# Altium schematic sheet power.SchDoc
size A4
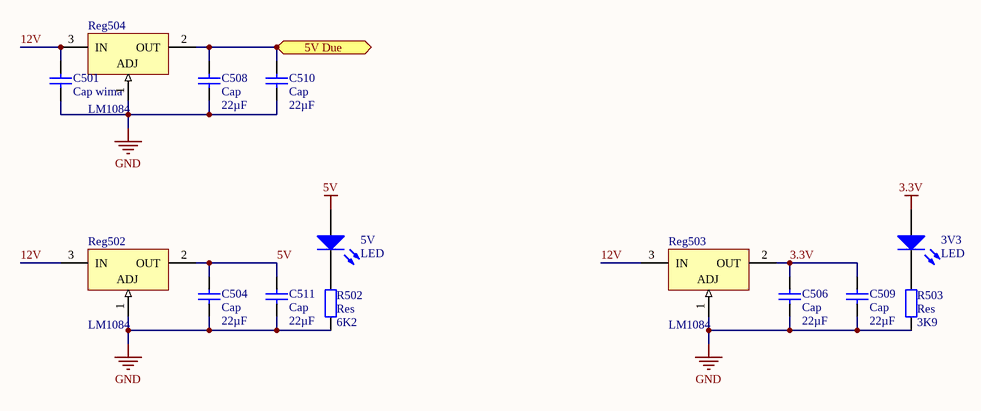
[diagram p0: power.SchDoc]

## Parts
3V3  LED  [LED 3mm]
5V  LED  [LED 3mm]
C501  Cap wima  [Wima 11x16x7.2mm]
C504  Cap  value 22µF  [1206 footprint]
C506  Cap  value 22µF  [1206 footprint]
C508  Cap  value 22µF  [1206 footprint]
C509  Cap  value 22µF  [1206 footprint]
C510  Cap  value 22µF  [1206 footprint]
C511  Cap  value 22µF  [1206 footprint]
R502  Res  value 6K2  [1206 footprint]
R503  Res  value 3K9  [1206 footprint]
Reg502  LM1084  [LM1084]
Reg503  LM1084  [LM1084]
Reg504  LM1084  [LM1084]

## Ports
5V Due (bidir)

## Nets
3.3V: 3V3.1(A) C506.2 C509.2 Reg503.2(OUT)
5V: 5V.1(A) C504.2 C511.2 Reg502.2(OUT)
GND: C501.1 C504.1 C506.1 C508.1 C509.1 C510.1 C511.1 R502.1 R503.1 Reg502.1(ADJ) Reg503.1(ADJ) Reg504.1(ADJ)
5V Due: C508.2 C510.2 Reg504.2(OUT) ; port 5V Due
12V: C501.2 Reg502.3(IN) Reg503.3(IN) Reg504.3(IN)
Net3V3_2: 3V3.2(K) R503.2
Net5V_2: 5V.2(K) R502.2